# Altium schematic sheet voeding.SchDoc
size A4; SheetNumber: 2; SheetTotal: 4
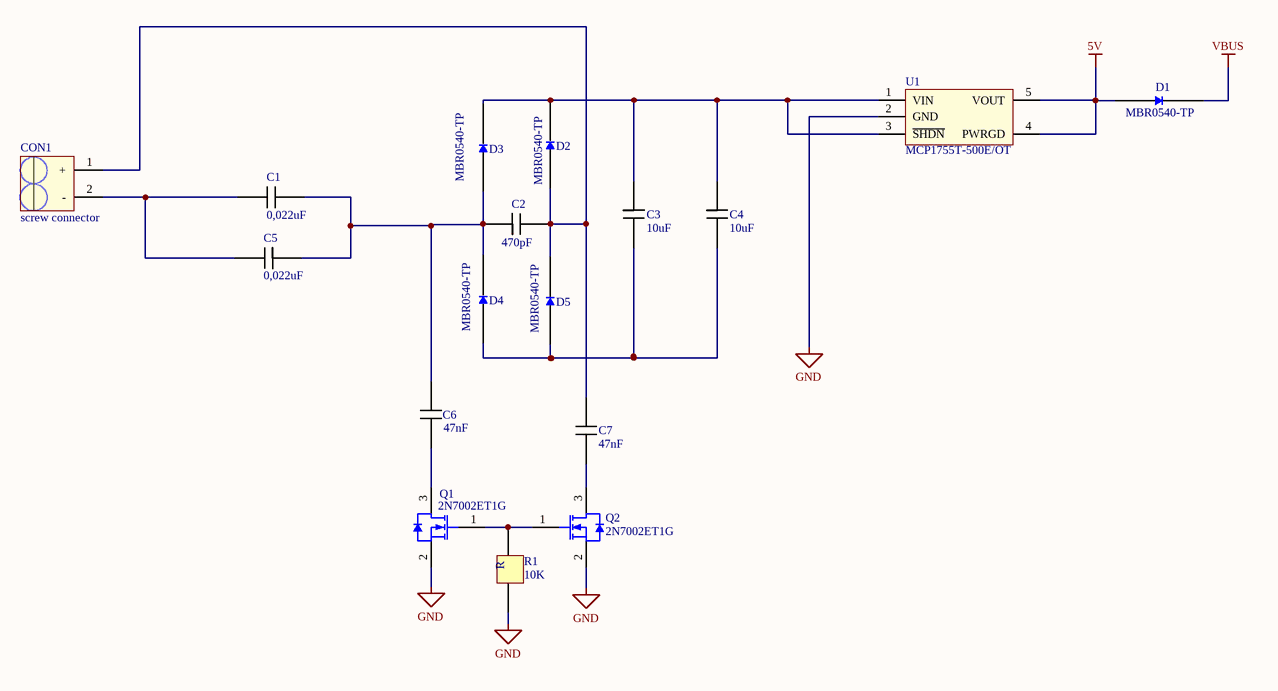
[diagram p0: voeding.SchDoc]

## Parts
C1  0,022uF  [0603]
C2  470pF  [0603]
C3  10uF  [0603]
C4  10uF  [0603]
C5  0,022uF  [0603]
C6  47nF  [0603]
C7  47nF  [0603]
CON1  screw connector  [qi coil]
D1  MBR0540-TP  [Diode]
D2  MBR0540-TP  [Diode]
D3  MBR0540-TP  [Diode]
D4  MBR0540-TP  [Diode]
D5  MBR0540-TP  [Diode]
Q1  2N7002ET1G  [N-channel FET]
Q2  2N7002ET1G  [N-channel FET]
R1  10K  [0603]
U1  MCP1755T-500E/OT  [AP2112 sot25]

## Nets
5V: D1.1 U1.4(PWRGD) U1.5(VOUT)
GND: Q1.2 Q2.2 R1.2 U1.2(GND)
VBUS: D1.2
NetC1_1: C1.1 C5.1 C6.1
NetC1_2: C1.2 C5.2 CON1.2(-)
NetC2_1: C2.1 D3.1 D4.2
NetC2_2: C2.2 C7.1 CON1.1(+) D2.1 D5.2
NetC3_1: C3.1 C4.1 D2.2 D3.2 U1.1(VIN) U1.3(~{SHDN})
NetC3_2: C3.2 C4.2 D4.1 D5.1
NetC6_2: C6.2 Q1.3
NetC7_2: C7.2 Q2.3
NetQ1_1: Q1.1 Q2.1 R1.1

## Notes on the sheet
- (in symbol resistor) R

## Library data of the parts
C1-C7 = capacitor
D1-D5 = diode
Q1 Q2 = fet
R1 = resistor